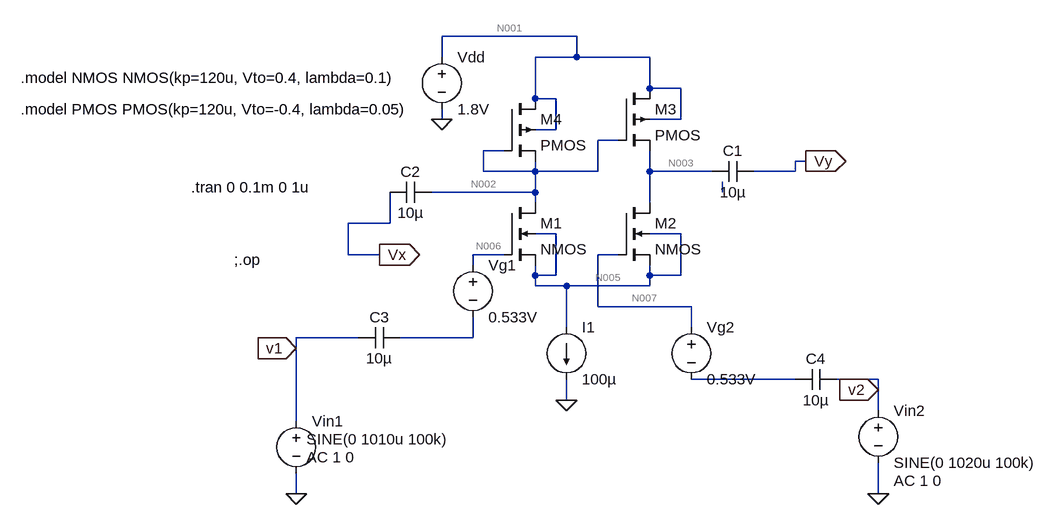
[diagram p0: schematic differential_amplifier_with_load.asc]
differential_amplifier_with_load.asc, the LTspice schematic file:
Version 4
SHEET 1 888 680
WIRE 160 -96 -48 -96
WIRE -48 -64 -48 -96
WIRE 160 -64 160 -96
WIRE 160 -64 96 -64
WIRE 272 -64 160 -64
WIRE 272 -16 272 -64
WIRE 320 -16 272 -16
WIRE 96 0 96 -64
WIRE 128 0 96 0
WIRE -48 32 -48 16
WIRE 320 32 320 -16
WIRE 320 32 272 32
WIRE 128 48 128 0
WIRE 128 48 96 48
WIRE 224 64 192 64
WIRE 48 80 16 80
WIRE 512 96 496 96
WIRE 16 112 16 80
WIRE 96 112 96 96
WIRE 96 112 16 112
WIRE 192 112 192 64
WIRE 192 112 96 112
WIRE 272 112 272 80
WIRE 368 112 272 112
WIRE 496 112 496 96
WIRE 496 112 432 112
WIRE 96 144 96 112
WIRE 96 144 -64 144
WIRE 384 144 384 128
WIRE 96 160 96 144
WIRE 272 160 272 112
WIRE -128 192 -128 144
WIRE -128 192 -192 192
WIRE 128 208 96 208
WIRE 320 208 272 208
WIRE -192 240 -192 192
WIRE -144 240 -192 240
WIRE 48 240 0 240
WIRE 224 240 192 240
WIRE 0 256 0 240
WIRE 96 272 96 256
WIRE 128 272 128 208
WIRE 128 272 96 272
WIRE 272 272 272 256
WIRE 320 272 320 208
WIRE 320 272 272 272
WIRE 96 288 96 272
WIRE 144 288 96 288
WIRE 272 288 272 272
WIRE 272 288 144 288
WIRE 192 320 192 240
WIRE 336 320 192 320
WIRE 144 352 144 288
WIRE 336 352 336 320
WIRE -176 368 -272 368
WIRE 0 368 0 336
WIRE 0 368 -112 368
WIRE -272 384 -272 368
WIRE 496 432 336 432
WIRE 624 432 560 432
WIRE 624 448 624 432
WIRE 144 464 144 432
WIRE 624 480 624 448
WIRE -272 496 -272 384
WIRE -272 608 -272 576
WIRE 624 608 624 560
FLAG 624 608 0
FLAG -272 608 0
FLAG 512 96 Vy
IOPIN 512 96 Out
FLAG -48 32 0
FLAG 144 464 0
FLAG -144 240 Vx
IOPIN -144 240 Out
FLAG -272 384 v1
IOPIN -272 384 In
FLAG 624 448 v2
IOPIN 624 448 In
SYMBOL nmos4 224 160 R0
SYMATTR InstName M2
SYMATTR Value2 l=10u w=468u
SYMBOL nmos4 48 160 R0
SYMATTR InstName M1
SYMATTR Value2 l=10u w=468u
SYMBOL pmos4 224 -16 R0
SYMATTR InstName M3
SYMATTR Value2 l=10u w=10u
SYMBOL pmos4 48 0 R0
SYMATTR InstName M4
SYMATTR Value2 l=10u w=10u
SYMBOL cap 432 96 R90
WINDOW 0 0 32 VBottom 2
WINDOW 3 32 32 VTop 2
SYMATTR InstName C1
SYMATTR Value 10µ
SYMBOL voltage 624 464 R0
WINDOW 123 24 124 Left 2
WINDOW 39 0 0 Left 0
SYMATTR InstName Vin2
SYMATTR Value SINE(0 1020u 100k)
SYMATTR Value2 AC 1 0
SYMBOL voltage -272 480 R0
WINDOW 3 16 44 Left 2
WINDOW 123 16 72 Left 2
WINDOW 39 0 0 Left 0
SYMATTR InstName Vin1
SYMATTR Value SINE(0 1010u 100k)
SYMATTR Value2 AC 1 0
SYMBOL voltage -48 -80 R0
WINDOW 123 0 0 Left 0
WINDOW 39 0 0 Left 0
SYMATTR InstName Vdd
SYMATTR Value 1.8V
SYMBOL current 144 352 R0
WINDOW 123 0 0 Left 0
WINDOW 39 0 0 Left 0
SYMATTR InstName I1
SYMATTR Value 100µ
SYMBOL voltage 336 336 R0
WINDOW 123 0 0 Left 0
WINDOW 39 0 0 Left 0
SYMATTR InstName Vg2
SYMATTR Value 0.533V
SYMBOL voltage 0 240 R0
WINDOW 123 0 0 Left 0
WINDOW 39 0 0 Left 0
SYMATTR InstName Vg1
SYMATTR Value 0.533V
SYMBOL cap -64 128 R90
WINDOW 0 0 32 VBottom 2
WINDOW 3 32 32 VTop 2
SYMATTR InstName C2
SYMATTR Value 10µ
SYMBOL cap -112 352 R90
WINDOW 0 0 32 VBottom 2
WINDOW 3 32 32 VTop 2
SYMATTR InstName C3
SYMATTR Value 10µ
SYMBOL cap 560 416 R90
WINDOW 0 0 32 VBottom 2
WINDOW 3 32 32 VTop 2
SYMATTR InstName C4
SYMATTR Value 10µ
TEXT -696 -32 Left 2 !.model NMOS NMOS(kp=120u, Vto=0.4, lambda=0.1)
TEXT -696 16 Left 2 !.model PMOS PMOS(kp=120u, Vto=-0.4, lambda=0.05)
TEXT -434 136 Left 2 !.tran 0 0.1m 0 1u
TEXT -368 248 Left 2 !;.op

The netlist it stands for:
* differential_amplifier_with_load.asc
M2 N003 N007 N005 N005 NMOS l=10u w=468u
M1 N002 N006 N005 N005 NMOS l=10u w=468u
M3 N001 N002 N003 N001 PMOS l=10u w=10u
M4 N001 N002 N002 N001 PMOS l=10u w=10u
C1 Vy N003 10µ
Vin2 v2 0 SINE(0 1020u 100k) AC 1 0
Vin1 v1 0 SINE(0 1010u 100k) AC 1 0
Vdd N001 0 1.8V
I1 N005 0 100µ
Vg2 N007 N009 0.533V
Vg1 N006 N008 0.533V
C2 N002 Vx 10µ
C3 N008 v1 10µ
C4 v2 N009 10µ
.model NMOS NMOS
.model PMOS PMOS
.lib standard.mos
.model NMOS NMOS(kp=120u, Vto=0.4, lambda=0.1)
.model PMOS PMOS(kp=120u, Vto=-0.4, lambda=0.05)
.tran 0 0.1m 0 1u
;.op
.backanno
.end

* Results of the author's LTspice run, read from the files saved beside the schematic
* Operating Point, zero values left out:
*   V(n003) = 515.1 mV
*   V(n007) = 533 mV
*   V(n005) = 2.852 mV
*   V(n002) = 515.1 mV
*   V(n006) = 533 mV
*   V(n001) = 1.8 V
*   V(vy) = 5.151 µV
*   V(vx) = 5.151 µV
*   Id(M4) = 50 µA
*   Ib(M4) = 1.295 pA
*   Is(M4) = -50 µA
*   Id(M3) = 50 µA
*   Ib(M3) = 1.295 pA
*   Is(M3) = -50 µA
*   Id(M1) = 50 µA
*   Is(M1) = -50 µA
*   Id(M2) = 50 µA
*   Is(M2) = -50 µA
*   I(I1) = 100 µA
*   I(Vdd) = -100 µA
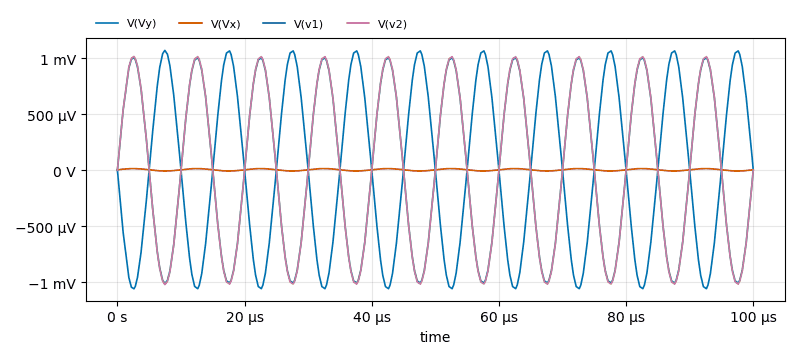
[diagram p1: Transient Analysis of differential_amplifier_with_load.asc, plotted from the saved traces]
* Transient Analysis, 1 run:
*   V(Vy): min -1.058 mV, max 1.072 mV, average 5.336 µV, rms 754 µV, last 5.152 µV
*   V(Vx): min -5.822 µV, max 16.08 µV, average 5.149 µV, rms 9.309 µV, last 5.151 µV
*   V(v1): min -1.01 mV, max 1.008 mV, average -156.1 nV, rms 724.6 µV, last 0 V
*   V(v2): min -1.02 mV, max 1.018 mV, average -157.6 nV, rms 731.8 µV, last 0 V